# Altium schematic sheet nse5310-module.SchDoc
size 304 x 203 mm
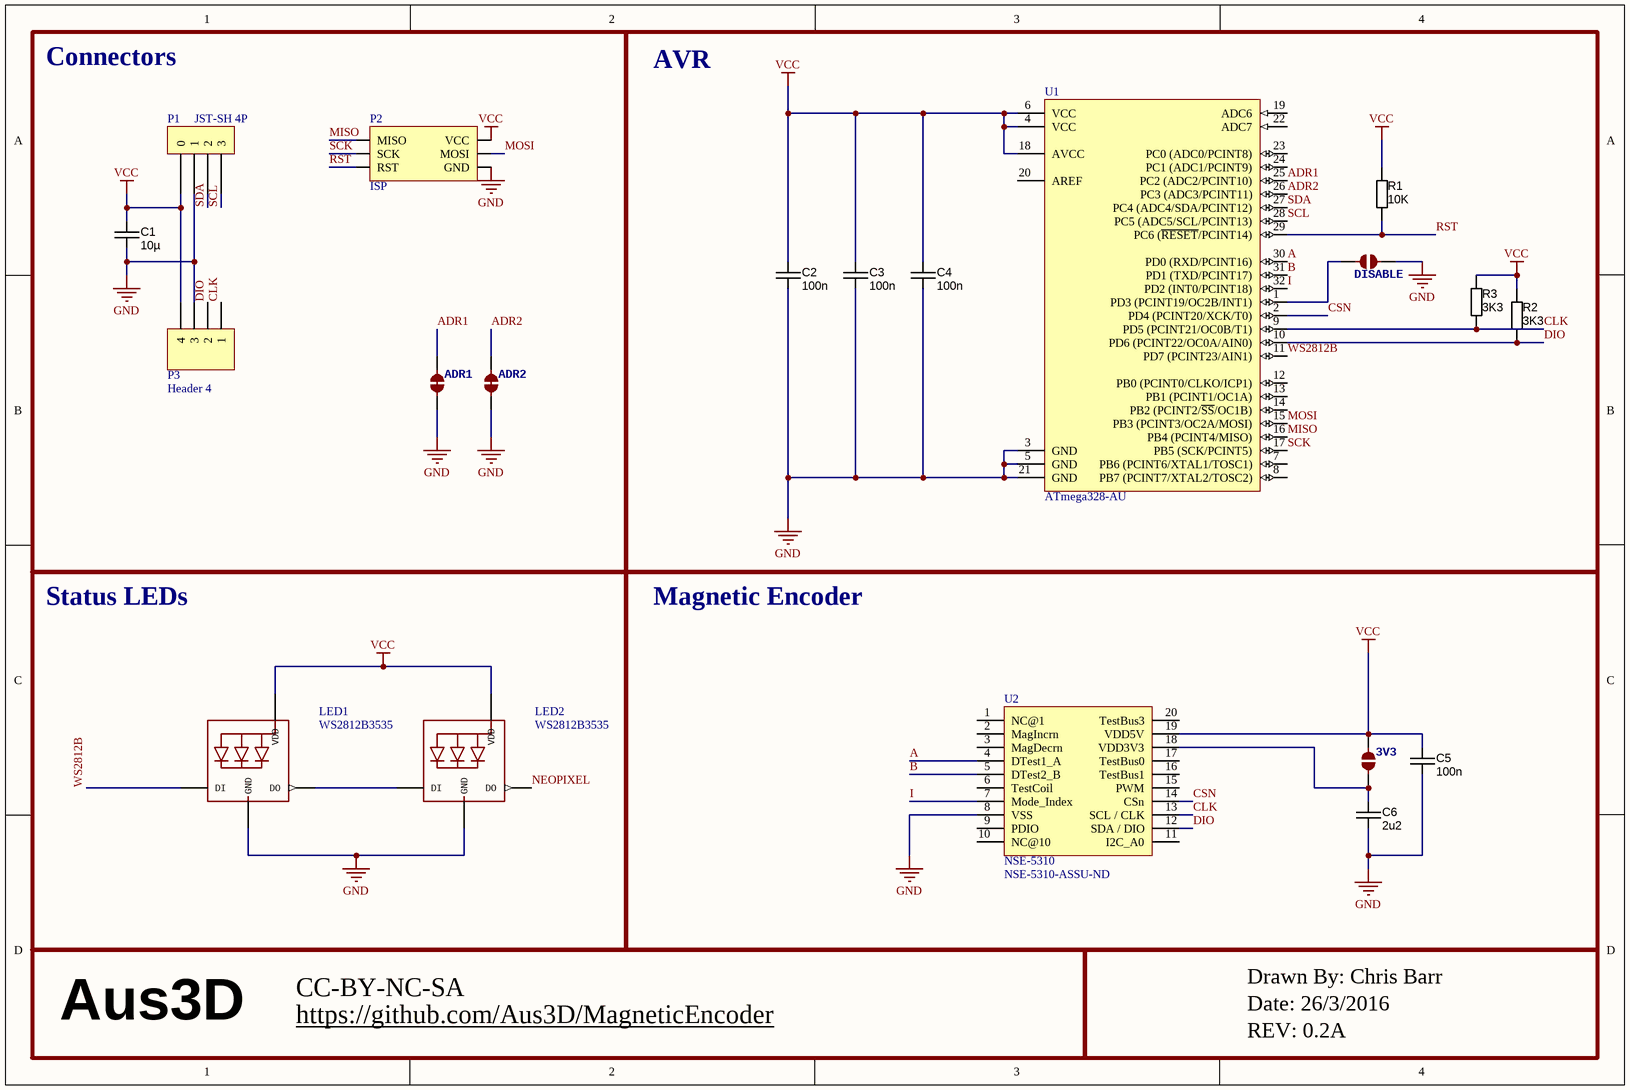
[diagram p0: nse5310-module.SchDoc]

## Parts
3V3  JUMPER-PAD-2-NO  [PAD-JUMPER-2-NO_NO_SILK]  (value not drawn)
ADR1  JUMPER-PAD-2-NC_BY_TRACE  [PAD-JUMPER-2-NC_BY_TRACE_YES_SILK]  (value not drawn)
ADR2  JUMPER-PAD-2-NC_BY_TRACE  [PAD-JUMPER-2-NC_BY_TRACE_YES_SILK]  (value not drawn)
C1  value 10µ  [CAPC2012X135N]  (hidden comment: approved sub OK)
C2  value 100n  [CAPC1608X90N]  (hidden comment: approved sub OK)
C3  value 100n  [CAPC1608X90N]  (hidden comment: approved sub OK)
C4  value 100n  [CAPC1608X90N]  (hidden comment: approved sub OK)
C5  value 100n  [CAPC1608X90N]  (hidden comment: approved sub OK)
C6  value 2u2  [CAPC1608X90N]  (hidden comment: approved sub OK)
DISABLE  JUMPER-PAD-2-NO  [PAD-JUMPER-2-NO_NO_SILK]  (value not drawn)
LED1  WS2812B3535  [LED3535]
LED2  WS2812B3535  [LED3535]
P1  JST-SH 4P  [SM04B-SRSS-TB]
P2  ISP  [ICSP Pads]  (no BOM)
P3  Header 4  [HDR1X4]
R1  value 10K  [RESC1608X55N]  (hidden comment: Thick Film)
R2  value 3K3  [RESC1608X55N]  (hidden comment: Thick Film)
R3  value 3K3  [RESC1608X55N]  (hidden comment: Thick Film)
U1  ATmega328-AU  [32A_N]
U2  NSE-5310  Supplier Part Number 1: NSE-5310-ASSU-ND  [NSE-5310]

## Blocks framed on the sheet
Connectors: ADR1 ADR2 C1 P1-P3
AVR: C2-C4 DISABLE R1-R3 U1
Status LEDs: LED1 LED2
Magnetic Encoder: 3V3 C5 C6 U2

## Nets
GND: ADR1.1 ADR2.1 C1.2 C2.2 C3.2 C4.2 C5.2 C6.2 DISABLE.1 LED1.4(GND) LED2.4(GND) P1.1 P2.5(GND) P3.3 U1.3(GND) U1.5(GND) U1.21(GND) U2.8(VSS)
VCC: 3V3.2 C1.1 C2.1 C3.1 C4.1 C5.1 LED1.2(VDD) LED2.2(VDD) P1.0 P2.1(VCC) P3.4 R1.1 R2.1 R3.1 U1.4(VCC) U1.6(VCC) U1.18(AVCC) U2.19(VDD5V)
A: U1.30(PD0_(RXD/PCINT16)) U2.4(DTest1_A)
ADR1: ADR1.2 U1.25(PC2_(ADC2/PCINT10))
ADR2: ADR2.2 U1.26(PC3_(ADC3/PCINT11))
B: U1.31(PD1_(TXD/PCINT17)) U2.5(DTest2_B)
CLK: P3.1 R3.2 U1.9(PD5_(PCINT21/OC0B/T1)) U2.13(SCL_/_CLK)
CSN: U1.2(PD4_(PCINT20/XCK/T0)) U2.14(CSn)
DIO: P3.2 R2.2 U1.10(PD6_(PCINT22/OC0A/AIN0)) U2.12(SDA_/_DIO)
I: U1.32(PD2_(INT0/PCINT18)) U2.7(Mode_Index)
MISO: P2.0(MISO) U1.16(PB4_(PCINT4/MISO))
MOSI: P2.3(MOSI) U1.15(PB3_(PCINT3/OC2A/MOSI))
NEOPIXEL: LED2.3(DO)
RST: P2.4(RST) R1.2 U1.29(PC6_(~{RESET}/PCINT14))
SCK: P2.2(SCK) U1.17(PB5_(SCK/PCINT5))
SCL: P1.3 U1.28(PC5_(ADC5/SCL/PCINT13))
SDA: P1.2 U1.27(PC4_(ADC4/SDA/PCINT12))
WS2812B: LED1.1(DI) U1.11(PD7_(PCINT23/AIN1))
Net3V3_1: 3V3.1 C6.1 U2.18(VDD3V3)
NetDISABLE_2: DISABLE.2 U1.1(PD3_(PCINT19/OC2B/INT1))
NetLED1_3: LED1.3(DO) LED2.1(DI)

Not connected (* = marked no-connect by the designer): U1 7(PB6_(PCINT6/XTAL1/TOSC1)) 8(PB7_(PCINT7/XTAL2/TOSC2)) 12(PB0_(PCINT0/CLKO/ICP1)) 13(PB1_(PCINT1/OC1A)) 14(PB2_(PCINT2/~{SS}/OC1B)) 19(ADC6) 20(AREF) 22(ADC7) 23(PC0_(ADC0/PCINT8)) 24(PC1_(ADC1/PCINT9)); U2 1(NC@1) 2(MagIncrn) 3(MagDecrn) 6(TestCoil) 9(PDIO) 10(NC@10) 11(I2C_A0) 15(PWM) 16(TestBus1) 17(TestBus0) 20(TestBus3)

## Notes on the sheet
- Aus3D
- https://github.com/Aus3D/MagneticEncoder
- CC-BY-NC-SA
- Drawn By: Chris Barr
- Date: 26/3/2016
- REV: 0.2A

## Library data of the parts
C1 = CAPC_10u_0805_10V: Capacitor SMD Cer 10uF 10% 10V X5R 0805; Manufacturer 1: AVX Corporation; Manufacturer Part Number 1: 0805ZD106KAT2A; Ratings: 10V; X5R; Material: ceramic; SCDType: spec; Package / Case: 0805 (2012 metric); Tolerance: ±10%; Manufacturer 2: Kemet; Manufacturer Part Number 2: C0805C106K8PACTU; Supplier 1: Digi-Key; Supplier Part Number 1: 478-5167-1-ND; ComponentLink1URL: http://www.avx.com/docs/Catalogs/cx5r.pdf; ComponentLink1Description: http://www.avx.com/docs/Catalogs/cx5r.pdf; ComponentLink2URL: http://www.kemet.com/datasheets&C0805C106K8PACTU; ComponentLink2Description: http://www.kemet.com/datasheets&C0805C106K8PACTU; Supplier 2: Digi-Key; Supplier Part Number 2: 399-4925-1-ND
C2-C5 = CAPC_100n_0603_X7R_50V_10%: Capacitor SMD Cer 100nF 10% 50V X7R 0603; Manufacturer 1: AVX Corporation; Manufacturer Part Number 1: 06035C104KAT2A; Ratings: 50V; X7R; Material: ceramic; SCDType: spec; Manufacturer 2: TDK Corporation; Manufacturer Part Number 2: C1608X7R1H104K; Package / Case: 0603 (1608 Metric); Tolerance: ±10%; Supplier 1: Digi-Key; Supplier Part Number 1: 478-5052-1-ND; ComponentLink1URL: http://www.avx.com/docs/Catalogs/cx7r.pdf; ComponentLink1Description: http://www.avx.com/docs/Catalogs/cx7r.pdf; Supplier 2: Digi-Key; Supplier Part Number 2: 445-1314-1-ND; ComponentLink2URL: http://product.tdk.com/capacitor/mlcc/en/documents/mlcc_commercial_general_en.pdf; ComponentLink2Description: http://product.tdk.com/capacitor/mlcc/en/documents/mlcc_commercial_general_en.pdf
C6 = CAPC_2u2_0603_10V_10%: Capacitor SMD Cer 2.2uF 10% 10V X5R 0603; Manufacturer 1: AVX Corporation; Manufacturer Part Number 1: 0603ZD225KAT2A; Ratings: 10V; X5R; Material: ceramic; SCDType: spec; Package / Case: 0603 (1608 metric); Tolerance: ±10%; Supplier 1: Digi-Key; Supplier Part Number 1: 478-6212-1-ND; ComponentLink1URL: http://www.avx.com/docs/Catalogs/cx5r.pdf; ComponentLink1Description: http://www.avx.com/docs/Catalogs/cx5r.pdf
LED1 LED2 = WS2812B3535: Manufacturer 1: DONGGUANG OPSCO OPTOELECTRONICS CO., LTD; Manufacturer Part Number 1: SK6812MINI
P1 = SM04B-SRSS-TB: Supplier 1: Digi-Key; Supplier Part Number 1: 455-1804-1-ND
P2 = ISP Header
P3 = Header 4: Header, 4-Pin; LatestRevisionDate: 17-Jul-2002; LatestRevisionNote: Re-released for DXP Platform.; Publisher: Altium Limited
R1 = RES_10K_0603_5%: Resistor SMD chip 10k Ohm 0.1W 5% 0603; Manufacturer 1: Yageo; Manufacturer Part Number 1: RC0603JR-0710KL; Ratings: 1/10 W; SCDType: spec; Package / Case: 0603 (1608 metric); Tolerance: ±5%; Material: Thick Film; Supplier 1: Digi-Key; Supplier Part Number 1: 311-10KGRCT-ND; Supplier 2: Digi-Key; Supplier Part Number 2: 541-10KGCT-ND; Manufacturer 2: Vishay Dale; Manufacturer Part Number 2: CRCW060310K0JNEA; ComponentLink2URL: http://www.vishay.com/doc?20035; ComponentLink2Description: http://www.vishay.com/doc?20035; ComponentLink1URL: http://www.yageo.com/documents/recent/PYu-RC0603_51_RoHS_L_4.pdf; ComponentLink1Description: http://www.yageo.com/documents/recent/PYu-RC0603_51_RoHS_L_4.pdf
R2 R3 = RES_3K3_0603_5%: Resistor SMD chip 3.3k Ohm 0.1W 5% 0603; Manufacturer 1: Yageo; Manufacturer Part Number 1: RC0603JR-073K3L; Ratings: 1/10 W; SCDType: undef; Package / Case: 0603 (1608 metric); Tolerance: ±5%; Material: thick film; Supplier 1: Digi-Key; Supplier Part Number 1: 311-3.3KGRTR-ND
U1 = ATmega328-AU: 8-bit AVR Microcontroller, 32KB Flash, 1KB EEPROM, 2KB SRAM, 32-pin TQFP, Industrial Grade (-40°C to 85°C); DatasheetVersion: revD, May-2011; PackageVersion: revC, Oct-2010; PackageReference: 32A; PackageDescription: 32-Lead, 7x7x1.0 mm Body, 0.8mm Lead Pitch, Thin Profile Plastic Quad Flat Package (TQFP); Code_JEDEC: MS-026-ABA; ComponentLink1Description: Manufacturer URL; ComponentLink1URL: http://www.atmel.com/; ComponentLink2Description: ATmega48A/48PA/88A/88PA/168A/168PA/328/328P Datasheet; ComponentLink2URL: http://www.atmel.com/dyn/resources/prod_documents/doc8271.pdf; ComponentLink3Description: ATmega48A/48PA/88A/88PA/168A/168PA/328/328P Summary; ComponentLink3URL: http://www.atmel.com/dyn/resources/prod_documents/8271S.pdf
U2 = NSE-5310: Supplier 1: Digi-Key